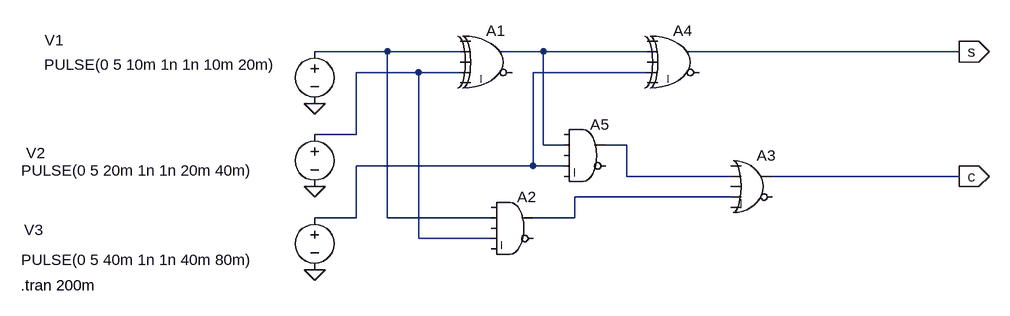
[diagram p0: schematic full adder.asc]
full adder.asc, the LTspice schematic file:
Version 4
SHEET 1 952 680
WIRE 0 64 -112 64
WIRE 112 64 0 64
WIRE 240 64 176 64
WIRE 400 64 240 64
WIRE 880 64 464 64
WIRE 48 96 -48 96
WIRE 112 96 48 96
WIRE 400 96 224 96
WIRE -48 192 -48 96
WIRE -48 192 -112 192
WIRE 240 208 240 64
WIRE 272 208 240 208
WIRE 368 208 336 208
WIRE 224 240 224 96
WIRE 224 240 -48 240
WIRE 272 240 224 240
WIRE 368 256 368 208
WIRE 528 256 368 256
WIRE 880 256 592 256
WIRE 528 288 288 288
WIRE -48 320 -48 240
WIRE -48 320 -112 320
WIRE 0 320 0 64
WIRE 160 320 0 320
WIRE 288 320 288 288
WIRE 288 320 224 320
WIRE 48 352 48 96
WIRE 160 352 48 352
FLAG -112 400 0
FLAG -112 144 0
FLAG -112 272 0
FLAG 880 64 s
IOPIN 880 64 Out
FLAG 880 256 c
IOPIN 880 256 Out
SYMBOL Digital\\xor 160 16 R0
SYMATTR InstName A1
SYMBOL Digital\\and 192 272 R0
SYMATTR InstName A2
SYMBOL Digital\\or 560 208 R0
SYMATTR InstName A3
SYMBOL voltage -112 48 R0
WINDOW 0 -415 -2 Left 2
WINDOW 3 -416 36 Left 2
WINDOW 123 0 0 Left 0
WINDOW 39 0 0 Left 0
SYMATTR InstName V1
SYMATTR Value PULSE(0 5 10m 1n 1n 10m 20m)
SYMBOL voltage -112 176 R0
WINDOW 0 -444 44 Left 2
WINDOW 3 -451 71 Left 2
WINDOW 123 0 0 Left 0
WINDOW 39 0 0 Left 0
SYMATTR InstName V2
SYMATTR Value PULSE(0 5 20m 1n 1n 20m 40m)
SYMBOL voltage -112 304 R0
WINDOW 0 -447 35 Left 2
WINDOW 3 -451 81 Left 2
WINDOW 123 0 0 Left 0
WINDOW 39 0 0 Left 0
SYMATTR InstName V3
SYMATTR Value PULSE(0 5 40m 1n 1n 40m 80m)
SYMBOL Digital\\xor 448 16 R0
SYMATTR InstName A4
SYMBOL Digital\\and 304 160 R0
SYMATTR InstName A5
TEXT -564 424 Left 2 !.tran 200m

The netlist it stands for:
* full adder.asc
A1 0 N001 0 N003 0 0 N002 0 XOR
A2 0 N001 0 N003 0 0 N006 0 AND
A3 0 N005 0 N006 0 0 c 0 OR
V1 N001 0 PULSE(0 5 10m 1n 1n 10m 20m)
V2 N003 0 PULSE(0 5 20m 1n 1n 20m 40m)
V3 N004 0 PULSE(0 5 40m 1n 1n 40m 80m)
A4 0 N002 0 N004 0 0 s 0 XOR
A5 0 N002 0 N004 0 0 N005 0 AND
.tran 200m
.backanno
.end